# EAGLE design digidog-v3 (EAGLE 7.7.0)
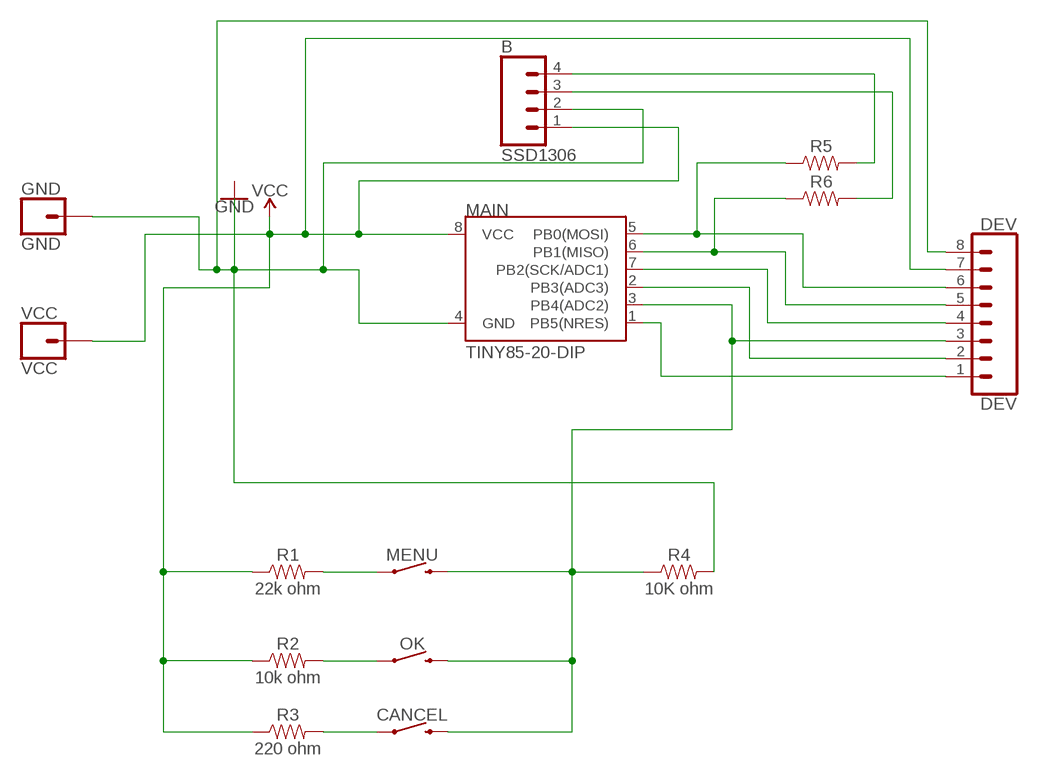
[diagram p0: schematic, sheet 1]

## Parts
B  SSD1306  CONN_04  [1X04]
CANCEL  MOMENTARY-SWITCH-SPST-PTH-6.0MM  [TACTILE_SWITCH_PTH_6.0MM]
DEV  DEV  CONN_08"  [1X08]
GND  GND  CONN_01  [1X01]
MAIN  TINY85-20-DIP  ATTINY45TINY85-20-DIP  [DIP08_MCU]
MENU  MOMENTARY-SWITCH-SPST-PTH-6.0MM  [TACTILE_SWITCH_PTH_6.0MM]
OK  MOMENTARY-SWITCH-SPST-PTH-6.0MM  [TACTILE_SWITCH_PTH_6.0MM]
R1  22k ohm  RESISTORAXIAL-0.3  [AXIAL-0.3]
R2  10k ohm  RESISTORAXIAL-0.3  [AXIAL-0.3]
R3  220 ohm  RESISTORAXIAL-0.3  [AXIAL-0.3]
R4  10K ohm  RESISTORAXIAL-0.3  [AXIAL-0.3]
R5  RESISTORAXIAL-0.3  [AXIAL-0.3]
R6  RESISTORAXIAL-0.3  [AXIAL-0.3]
VCC  VCC  CONN_01  [1X01]

## Nets
BUTTON: CANCEL.3 DEV.3 MAIN.3(PB4(ADC2)) MENU.3 OK.3 R4.P$1
GND: B.2 DEV.8 GND.1 MAIN.4(GND) R4.P$2
N$1: B.4 R5.P$2
N$2: MENU.1 R1.P$2
N$3: OK.1 R2.P$2
N$4: CANCEL.1 R3.P$2
N$5: DEV.6 MAIN.5(PB0(MOSI)) R5.P$1
N$6: DEV.5 MAIN.6(PB1(MISO)) R6.P$1
N$7: B.3 R6.P$2
N$8: DEV.1 MAIN.1(PB5(NRES))
N$9: DEV.2 MAIN.2(PB3(ADC3))
N$10: DEV.4 MAIN.7(PB2(SCK/ADC1))
VCC: B.1 DEV.7 MAIN.8(VCC) R1.P$1 R2.P$1 R3.P$1 VCC.1

## Library data of the parts
B = SparkFun-Connectors:CONN_04: Multi connection point. Often used as Generic Header-pin footprint for 0.1 inch spaced/style header connections On any of the 0.1 inch spaced packages, you can populate with these: Break Away Headers - Straight <https://www.sparkfun.com/products/116> (PRT-00116) Break Away Male Headers - Right Angle <https://www.sparkfun.com/products/553> (PRT-00553) Female Headers <https://www.sparkfun.com/products/115> (PRT-00115) Break Away Headers - Machine Pin <https://www.sparkfun.com/products/117> (PRT-00117) Break Away Female Headers - Swiss Machine Pin <https://www.sparkfun.com/products/743> (PRT-00743) For SCREWTERMINALS and SPRING TERMINALS visit here: Screw Terimnals on SparkFun.com <https://www.sparkfun.com/search/results?term=Screw+Terminals> (5mm/3.5mm/2.54mm spacing) This device is also useful as a general connection point to wire up your design to another part of your project. Our various solder wires solder well into these plated through hole pads. Hook-Up Wire - Assortment (Stranded, 22 AWG) <https://www.sparkfun.com/products/11375> (PRT-11375) Hook-Up Wire - Assortment (Solid Core, 22 AWG) <https://www.sparkfun.com/products/11367> (PRT-11367) View the entire wire category on our website here <https://www.sparkfun.com/categories/141> Special notes: Molex polarized connector foot print use with SKU : PRT-08231 with associated crimp pins and housings. 1MM SMD Version SKU: PRT-10208; PROD_ID: CONN-09696
CANCEL MENU OK = SparkFun-Switches:MOMENTARY-SWITCH-SPST: Momentary Switch (Pushbutton) - SPST Normally-open (NO) SPST momentary switches (buttons, pushbuttons). Variants PTH-12MM - 12mm square, through-hole Momentary Pushbutton Switch - 12mm Square <https://www.sparkfun.com/products/9190> (COM-09190) PTH-6.0MM, PTH-6.0MM-KIT - 6.0mm square, through-hole Mini Pushbutton Switch <https://www.sparkfun.com/products/97> (COM-00097) KIT package intended for soldering kit's - only one side of pads' copper is exposed. PTH-RIGHT-ANGLE-KIT - Right-angle, through-hole Right Angle Tactile Button <https://www.sparkfun.com/products/10791> - Used on SparkFun BigTime Watch Kit <https://www.sparkfun.com/products/11734> SMD-12MM - 12mm square, surface-mount Tactile Button - SMD (12mm) <https://www.sparkfun.com/products/12993> (COM-12993) Used on SparkFun PicoBoard <https://www.sparkfun.com/products/11888> SMD-4.5MM - 4.5mm Square Trackball Switch Used on SparkFun Blackberry Trackballer Breakout <https://www.sparkfun.com/products/13169> SMD-4.6MMX2.8MM - 4.60mm x 2.80mm, surface mount Used on SparkFun SAMD21 Mini Breakout <https://www.sparkfun.com/products/13664> SMD-5.2MM, SMD-5.2-REDUNDANT - 5.2mm square, surface-mount Mini Pushbutton Switch - SMD <https://www.sparkfun.com/products/8720> (COM-08720) Used on Arduino Pro Mini <https://www.sparkfun.com/products/11114> REDUNDANT package connects both switch circuits together SMD-6.0X3.5MM - 6.0 x 3.5mm, surface mount Momentary Reset Switch SMD <https://www.sparkfun.com/products/8229> (COM-08229) SMD-6.2MM-TALL - 6.2mm square, surface mount Tactile Button - SMD (6mm) <https://www.sparkfun.com/products/12992> Used on SparkFun Digital Sandbox <https://www.sparkfun.com/products/12651> SMD-RIGHT-ANGLE - Right-angle, surface mount Used on SparkFun Block for Intel® Edison - Arduino <https://www.sparkfun.com/products/13036>; PROD_ID: SWCH-08441; SF_SKU: COM-00097
DEV = SparkFun-Connectors:CONN_08: Multi connection point. Often used as Generic Header-pin footprint for 0.1 inch spaced/style header connections On any of the 0.1 inch spaced packages, you can populate with these: Break Away Headers - Straight <https://www.sparkfun.com/products/116> (PRT-00116) Break Away Male Headers - Right Angle <https://www.sparkfun.com/products/553> (PRT-00553) Female Headers <https://www.sparkfun.com/products/115> (PRT-00115) Break Away Headers - Machine Pin <https://www.sparkfun.com/products/117> (PRT-00117) Break Away Female Headers - Swiss Machine Pin <https://www.sparkfun.com/products/743> (PRT-00743) Arduino Stackable Header - 8 Pin <https://www.sparkfun.com/products/9279> (PRT-09279) For SCREWTERMINALS and SPRING TERMINALS visit here: Screw Terimnals on SparkFun.com <https://www.sparkfun.com/search/results?term=Screw+Terminals> (5mm/3.5mm/2.54mm spacing) This device is also useful as a general connection point to wire up your design to another part of your project. Our various solder wires solder well into these plated through hole pads. Hook-Up Wire - Assortment (Stranded, 22 AWG) <https://www.sparkfun.com/products/11375> (PRT-11375) Hook-Up Wire - Assortment (Solid Core, 22 AWG) <https://www.sparkfun.com/products/11367> (PRT-11367) View the entire wire category on our website here <https://www.sparkfun.com/categories/141> Special notes: Molex polarized connector foot print use with SKU : PRT-08231 with associated crimp pins and housings. 1MM SMD Version SKU: PRT-10208 NOTES ON THE VARIANTS LOCK and LOCK_LONGPADS... This footprint was designed to help hold the alignment of a through-hole component (i.e. 6-pin header) while soldering it into place. You may notice that each hole has been shifted either up or down by 0.005 of an inch from it's more standard position (which is a perfectly straight line). This slight alteration caused the pins (the squares in the middle) to touch the edges of the holes. Because they are alternating, it causes a "brace" to hold the component in place. 0.005 has proven to be the perfect amount of "off-center" position when using our standard breakaway headers. Although looks a little odd when you look at the bare footprint, once you have a header in there, the alteration is very hard to notice. Also,if you push a header all the way into place, it is covered up entirely on the bottom side.; PROD_ID: CONN-08438
GND VCC = SparkFun-Connectors:CONN_01: Single connection point. Often used as Generic Header-pin footprint for 0.1 inch spaced/style header connections On any of the 0.1 inch spaced packages, you can populate with these: Break Away Headers - Straight <https://www.sparkfun.com/products/116> (PRT-00116) Break Away Male Headers - Right Angle <https://www.sparkfun.com/products/553> (PRT-00553) Female Headers <https://www.sparkfun.com/products/115> (PRT-00115) Break Away Headers - Machine Pin <https://www.sparkfun.com/products/117> (PRT-00117) Break Away Female Headers - Swiss Machine Pin <https://www.sparkfun.com/products/743> (PRT-00743) This device is also useful as a general connection point to wire up your design to another part of your project. Our various solder wires solder well into these plated through hole pads. Hook-Up Wire - Assortment (Stranded, 22 AWG) <https://www.sparkfun.com/products/11375> (PRT-11375) Hook-Up Wire - Assortment (Solid Core, 22 AWG) <https://www.sparkfun.com/products/11367> (PRT-11367) View the entire wire category on our website here <https://www.sparkfun.com/categories/141> Special notes: SMTSO-256-ET is a "flush mount" nut for a 4-40 screw. We mostly use this on specialty testbeds; it is a nice way to connect hardware to your PCB at an adjustable hieght. Also note, the SNAP packages are for using a snappable style connector. We sell a baggie of snaps and they are also used on two LilyPad designs: Snap Assortment - 30 pack (male and female) <https://www.sparkfun.com/products/11347> (DEV-11347) LilyPad Arduino SimpleSnap <https://www.sparkfun.com/products/10941> (DEV-10941) LilyPad SimpleSnap Protoboard <https://www.sparkfun.com/products/10940> (DEV-10940)
MAIN = SparkFun-Retired:ATTINY45: Atmel 8-pin 2/4/8kB flash uC Retired; PROD_ID: IC-09445
R1-R6 = SparkFun-Resistors:RESISTOR: Generic Resistor Package

## Board
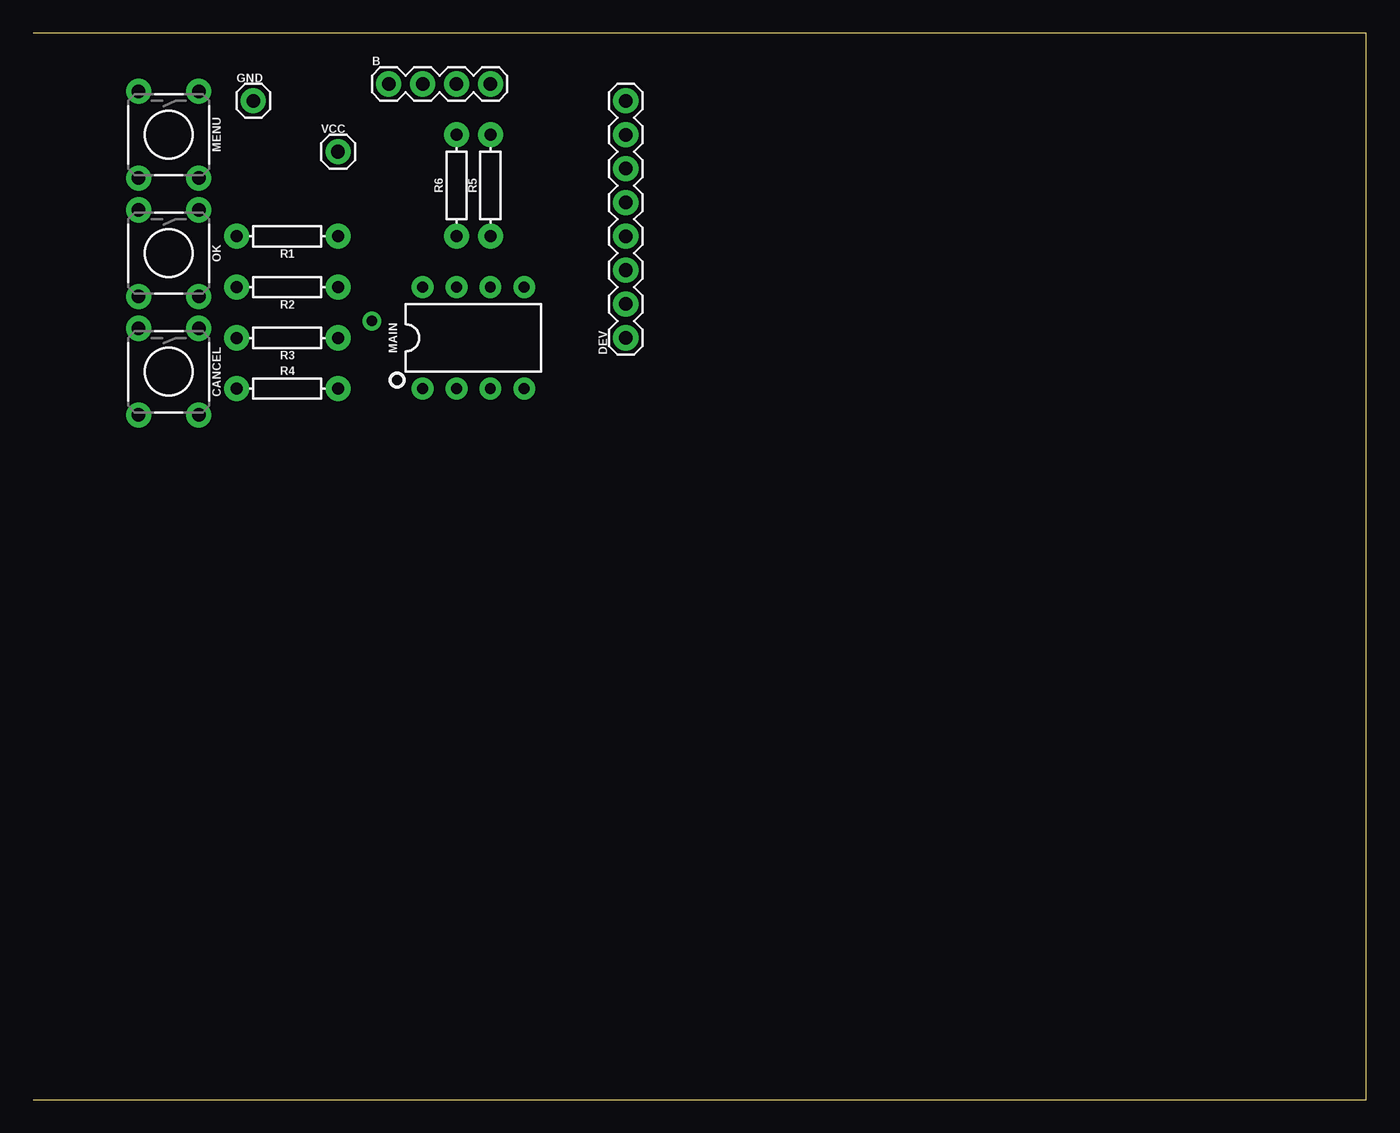
[diagram p1: board, top side]
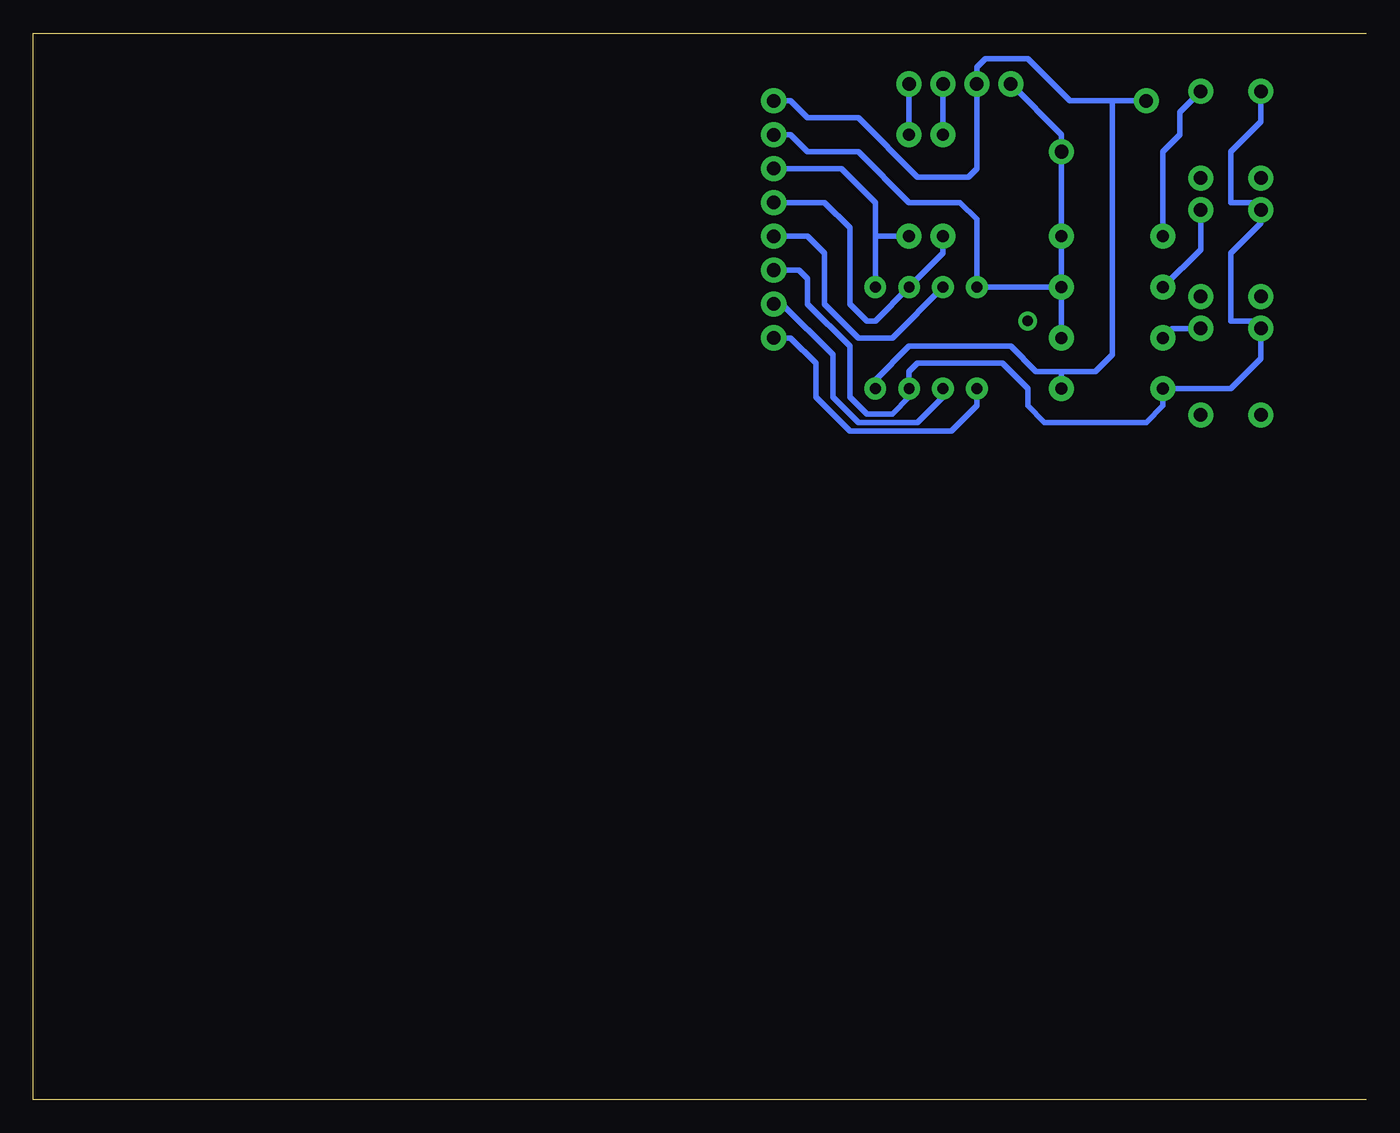
[diagram p2: board, bottom side, seen from below]

Size 100 x 80 mm. Coordinates in mm from the lower left corner, seen from the top.
Outline: 0,0 100,0 100,80 0,80
Copper layers (1*16): Top 0.035mm / dielectric 1.5mm / Bottom 0.035mm
Design rules "default": minimum track width 10mil, minimum drill 24mil, track to track 8mil, track to pad 8mil, pad to pad 8mil, via to via 8mil, smd to smd 8mil, copper to edge 40mil, drill to drill 8mil, minimum pad ring 10mil, minimum via ring 8mil, stop-mask expansion 4mil, vias tented up to drill 0mil, thermal gap 10mil

### Footprints (pad centres in the part's own frame; a part is rotated, then mirrored left to right if it is on the bottom)
1X04 = drill 1.016 pad 1.88: 1 0,0; 2 2.54,0; 3 5.08,0; 4 7.62,0
TACTILE_SWITCH_PTH_6.0MM = drill 1.016 pad 1.88: 1 -3.251,2.261; 2 3.251,2.261; 3 -3.251,-2.261; 4 3.251,-2.261
1X08 = drill 1.016 pad 1.88: 1 0,0; 2 2.54,0; 3 5.08,0; 4 7.62,0; 5 10.16,0; 6 12.7,0; 7 15.24,0; 8 17.78,0
1X01 = drill 1.016 pad 1.88: 1 0,0
DIP08_MCU = drill 0.813 pad 1.626: 1 -3.81,-3.81; 2 -1.27,-3.81; 3 1.27,-3.81; 4 3.81,-3.81; 5 3.81,3.81; 6 1.27,3.81; 7 -1.27,3.81; 8 -3.81,3.81
AXIAL-0.3 = drill 0.9 pad 1.88: P$1 -3.81,0; P$2 3.81,0

### Placement (x,y rotation side)
B  26.67,76.2 0 top
CANCEL  10.16,54.61 270 top
DEV  44.45,57.15 90 top
GND  16.51,74.93 0 top
MAIN  33.02,57.15 0 top
MENU  10.16,72.39 270 top
OK  10.16,63.5 270 top
R1  19.05,64.77 180 top
R2  19.05,60.96 180 top
R3  19.05,57.15 180 top
R4  19.05,53.34 0 top
R5  34.29,68.58 90 top
R6  31.75,68.58 90 top
VCC  22.86,71.12 0 top

### Tracks (layer width: path | path; a pad name or v marks a point on that pad's centre or on a via)
BUTTON
  Bottom 0.406: MENU.3 7.9,73.38 10.16,71.12 10.16,67.31 8.46,67.31 OK.3 7.9,65.76 10.16,63.5 10.16,58.42 8.46,58.42 CANCEL.3 7.9,55.6 10.16,53.34 R4.P$1 15.24,52.07 16.51,50.8 24.13,50.8 25.4,52.07 25.4,53.34 27.3,55.24 33.66,55.24 34.29,54.61 MAIN.3 34.29,52.7 35.56,51.44 37.47,51.44 38.73,52.7 38.73,56.52 41.91,59.69 41.91,61.59 42.55,62.23 DEV.3
GND
  Bottom 0.406: GND.1 19.05,74.93 | 19.05,74.93 22.23,74.93 25.4,78.11 28.57,78.11 29.21,77.47 B.2 29.21,69.85 29.84,69.22 33.66,69.22 38.1,73.66 41.91,73.66 43.18,74.93 DEV.8 | R4.P$2 22.86,54.61 | 22.86,54.61 24.77,54.61 26.67,56.52 34.29,56.52 36.83,53.98 MAIN.4 | 22.86,54.61 20.32,54.61 19.05,55.88 19.05,74.93
N$1
  Bottom 0.406: R5.P$2 B.4
N$2
  Bottom 0.406: R1.P$2 15.24,71.12 13.97,72.39 13.97,74.09 MENU.1
N$3
  Bottom 0.406: OK.1 12.42,63.78 R2.P$2
N$4
  Bottom 0.406: CANCEL.1 14.53,57.86 R3.P$2
N$5
  Bottom 0.406: DEV.6 39.37,69.85 36.83,67.31 36.83,64.77 | 36.83,64.77 MAIN.5 | R5.P$1 36.83,64.77
N$6
  Bottom 0.406: R6.P$1 31.75,63.5 MAIN.6 36.83,58.42 37.47,58.42 38.73,59.69 38.73,65.41 40.64,67.31 DEV.5
N$7
  Bottom 0.406: R6.P$2 B.3
N$8
  Bottom 0.406: DEV.1 43.18,57.15 41.27,55.24 41.27,52.7 38.73,50.16 31.11,50.16 29.21,52.07 MAIN.1
N$9
  Bottom 0.406: DEV.2 43.81,59.69 40.01,55.88 40.01,52.7 38.1,50.8 33.66,50.8 31.75,52.7 MAIN.2
N$10
  Bottom 0.406: DEV.4 41.91,64.77 40.64,63.5 40.64,59.69 38.1,57.15 35.56,57.15 MAIN.7
N$11  (via drill 0.8 pad 1.42)
  other vias: 25.4,58.42
VCC
  Bottom 0.406: R2.P$1 R1.P$1 VCC.1 22.86,72.39 B.1 | R2.P$1 R3.P$1 | R2.P$1 MAIN.8 29.21,66.04 30.48,67.31 34.29,67.31 38.1,71.12 41.91,71.12 43.18,72.39 DEV.7